# Altium schematic sheet GPS_tracker MCU.SchDoc
size 420 x 297 mm; SheetNumber: 1; SheetTotal: 3; ProjectTitle: Prj name
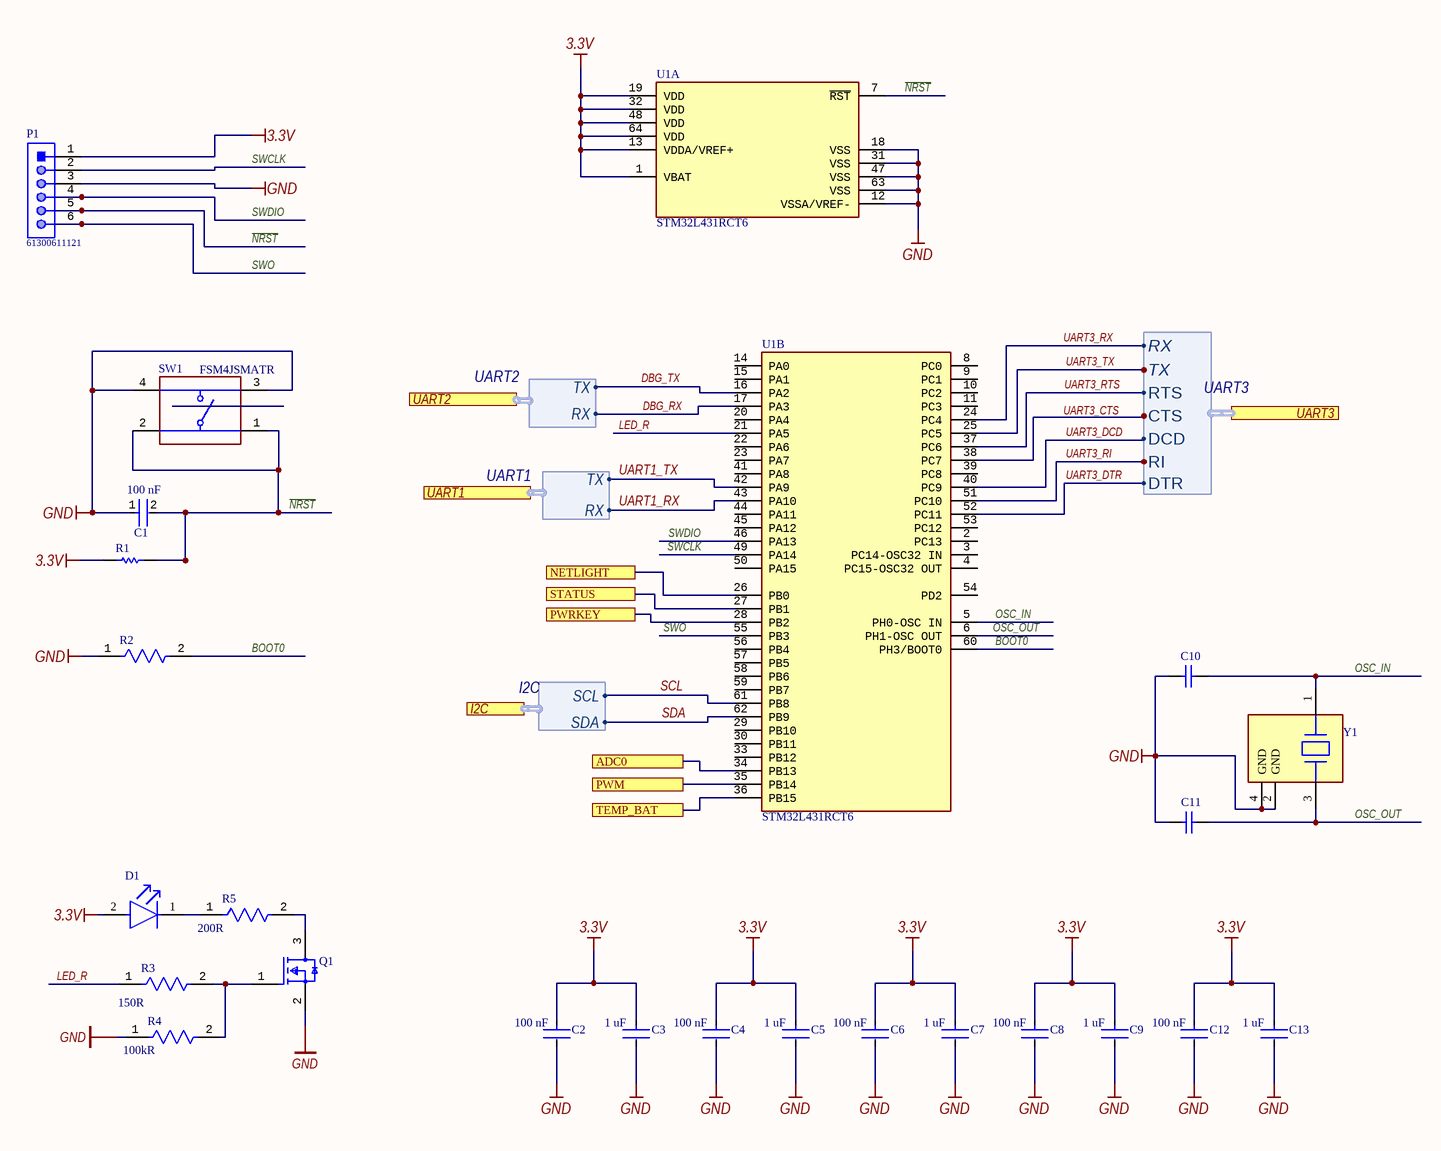
[diagram p0: GPS_tracker MCU.SchDoc]

## Parts
C1  Capacitance: 100 nF  [FP-CC0603-DA-MFG]  (hidden comment: CC0603KRX7R7BB104)
C2  Capacitance: 100 nF  [FP-CC0603-DA-MFG]  (hidden comment: CC0603KRX7R7BB104)
C3  Capacitance: 1 uF  [FP-CC0603-DA-MFG]  (hidden comment: CC0603KRX7R7BB105)
C4  Capacitance: 100 nF  [FP-CC0603-DA-MFG]  (hidden comment: CC0603KRX7R7BB104)
C5  Capacitance: 1 uF  [FP-CC0603-DA-MFG]  (hidden comment: CC0603KRX7R7BB105)
C6  Capacitance: 100 nF  [FP-CC0603-DA-MFG]  (hidden comment: CC0603KRX7R7BB104)
C7  Capacitance: 1 uF  [FP-CC0603-DA-MFG]  (hidden comment: CC0603KRX7R7BB105)
C8  Capacitance: 100 nF  [FP-CC0603-DA-MFG]  (hidden comment: CC0603KRX7R7BB104)
C9  Capacitance: 1 uF  [FP-CC0603-DA-MFG]  (hidden comment: CC0603KRX7R7BB105)
C10  CC0603JRNPO9BN180  [CAPC1608X90X40LL10T20]  (value not drawn)
C11  CC0603JRNPO9BN180  [CAPC1608X90X40LL10T20]  (value not drawn)
C12  Capacitance: 100 nF  [FP-CC0603-DA-MFG]  (hidden comment: CC0603KRX7R7BB104)
C13  Capacitance: 1 uF  [FP-CC0603-DA-MFG]  (hidden comment: CC0603KRX7R7BB105)
D1  150060RS75000  [FP-150060RS75000-MFG]  (value not drawn)
P1  61300611121  [61300611121]
Q1  MMBF170LT1G  [FP-318-08-IPC_B]  (value not drawn)
R1  ERJ3EKF1002V  [RESC1609X55X30LL15T15]  (value not drawn)
R2  AC0603FR-071KL  [FP-AC0603-IPC_B]  (value not drawn)
R3  Resistance: 150R  [FP-AC0603-MFG]  (hidden comment: AC0603FR-07150RL)
R4  Resistance: 100kR  [FP-RC0603-0_55-MFG]  (hidden comment: RC0603FR-07100KL)
R5  Resistance: 200R  [FP-ERJ3EK-IPC_C]  (hidden comment: ERJ-3EKF2000V)
SW1  FSM4JSMATR  [TECO-FSM4JSMATR_V]
U1  STM32L431RCT6  [FP-LQFP64-5W-MFG]  (parts A,B of 2)
Y1  ABM3B-8.000MHZ-B2-T  [FP-ABM3B-MFG]  (value not drawn)

## Ports
ADC0, I2C (harness I2C), NETLIGHT, PWM, PWRKEY, STATUS, TEMP_BAT, UART1 (harness UART1), UART2 (harness UART2), UART3 (harness UART3)

## Harnesses
UART1: RX, TX
UART2: RX, TX
I2C: SCL, SDA
UART3: RX, TX, RTS, CTS, DCD, RI, DTR

## Nets
3.3V: C2.1 C3.1 C4.1 C5.1 C6.1 C7.1 C8.1 C9.1 C12.1 C13.1 D1.2(A) P1.1 R1.1 U1.1(VBAT) U1.13(VDDA/VREF+) U1.19(VDD) U1.32(VDD) U1.48(VDD) U1.64(VDD)
GND: C1.1 C2.2 C3.2 C4.2 C5.2 C6.2 C7.2 C8.2 C9.2 C10.1 C11.1 C12.2 C13.2 P1.3 Q1.2(S) R2.1 R4.1 SW1.3 SW1.4 U1.12(VSSA/VREF-) U1.18(VSS) U1.31(VSS) U1.47(VSS) U1.63(VSS) Y1.2(GND) Y1.4(GND)
ADC0: U1.34(PB13) ; port ADC0
BOOT0: R2.2 U1.60(PH3/BOOT0)
DBG_RX: U1.17(PA3) ; port UART2.RX
LED_R: R3.1 U1.21(PA5)
~{NRST}: C1.2 P1.5 R1.2 SW1.1 SW1.2 U1.7(~{RST})
NETLIGHT: U1.26(PB0) ; port NETLIGHT
OSC_IN: C10.2 U1.5(PH0-OSC_IN) Y1.1
OSC_OUT: C11.2 U1.6(PH1-OSC_OUT) Y1.3
PWM: U1.35(PB14) ; port PWM
PWRKEY: U1.28(PB2) ; port PWRKEY
SCL: U1.61(PB8) ; port I2C.SCL
SDA: U1.62(PB9) ; port I2C.SDA
STATUS: U1.27(PB1) ; port STATUS
SWCLK: P1.2 U1.49(PA14)
SWDIO: P1.4 U1.46(PA13)
SWO: P1.6 U1.55(PB3)
TEMP_BAT: U1.36(PB15) ; port TEMP_BAT
UART1_RX: U1.43(PA10) ; port UART1.RX
UART1_TX: U1.42(PA9) ; port UART1.TX
UART3_DCD: U1.40(PC9) ; port UART3.DCD
UART3_DTR: U1.52(PC11) ; port UART3.DTR
UART3_RI: U1.51(PC10) ; port UART3.RI
UART3_RTS: U1.37(PC6) ; port UART3.RTS
UART3_RX: U1.24(PC4) ; port UART3.RX
UART3_TX: U1.25(PC5) ; port UART3.TX
NetD1_1: D1.1(C) R5.1
NetQ1_1: Q1.1(G) R3.2 R4.2
NetQ1_3: Q1.3(D) R5.2
NetU1_16: U1.16(PA2) ; port UART2.TX
NetU1_38: U1.38(PC7) ; port UART3.CTS

Not connected (* = marked no-connect by the designer): U1 2(PC13) 3(PC14-OSC32_IN) 4(PC15-OSC32_OUT) 8(PC0) 9(PC1) 10(PC2) 11(PC3) 14(PA0) 15(PA1) 20(PA4) 22(PA6) 23(PA7) 29(PB10) 30(PB11) 33(PB12) 39(PC8) 41(PA8) 44(PA11) 45(PA12) 50(PA15) 53(PC12) 54(PD2) 56(PB4) 57(PB5) 58(PB6) 59(PB7)

## Notes on the sheet
- Labels drawn without touching a wire or pin: DBG_TX, UART3_CTS
- Title:
- Author:
- Approved:
- Size:
- Date:
- Git Hash:
- A3
- Prj:
- Sheet
- of
- SW Version:
- Variant:
- Edited:
- CONFIDENTIAL
- File:

## Library data of the parts
C1 C2 C4 C6 C8 C12 = CMP-2000-05002-2: CAP CER 0.1UF 16V X7R 0603; Manufacturer: YAGEO; Tolerance: 0.1; Value: 100 nF; Temperature Coefficient: 15%; Material: Ceramic; Voltage Rating: 16 V; Package: CC0603-DA; ComponentLink2Description: Datasheet; Octopart: https://octopart.com/cc0603krx7r7bb104-yageo-192941; Temperature Range High: +125°C; Digikey Description: CAP CER 0.1UF 16V X7R 0603; Voltage: 16 V; Device Class L2: Capacitors; Height: 0.9mm; Temperature: -55°C to +125°C; Manufacturer Part Number: CC0603KRX7R7BB104; Device Class L1: Passive Components; Device Class L3: Ceramic Capacitors; ComponentLink2URL: http://www.yageo.com/documents/recent/UPY-GPHC_X7R_6.3V-to-50V_18.pdf; Footprint Url: http://www.yageo.com/exep/pages/download/literatures/UPY-C_GEN_24.pdf; RoHS: TRUE; Temperature Range Low: -55°C; Temperature Characteristic: X7R; Lead Free: Yes; Category: Cap; Mouser Description: Multilayer Ceramic Capacitor, CC Series, 0.1 - F, - 10%, X7R, 16 V, 0603 [1608 Metric]; Automotive: No
C3 C5 C7 C9 C13 = CMP-03422-000924-1: CAP CER 1UF 16V X7R 0603; Manufacturer: YAGEO; Tolerance: 0.1; Temperature Coefficient: 15%; Material: Ceramic; Package: CC0603-DA; RoHS: TRUE; Device Class L2: Capacitors; Temperature Characteristic: X7R; Temperature: -55°C to +125°C; Temperature Range Low: -55°C; Automotive: No; ComponentLink2Description: Datasheet; Value: 1 uF; Lead Free: Yes; ComponentLink2URL: http://www.yageo.com/documents/recent/UPY-GPHC_X7R_6.3V-to-50V_18.pdf; Device Class L1: Passive Components; Voltage: 16 V; Octopart: https://octopart.com/cc0603krx7r7bb105-yageo-42271928; Category: Cap; Digikey Description: CAP CER 1UF 16V X7R 0603; Footprint Url: http://www.yageo.com/exep/pages/download/literatures/UPY-C_GEN_24.pdf; Height: 0.9mm; Manufacturer Part Number: CC0603KRX7R7BB105; Voltage Rating: 16 V; Temperature Range High: +125°C; Mouser Description: Multilayer Ceramic Capacitor, CC Series, 1 - F, - 10%, X7R, 16 V, 0603 [1608 Metric]; Device Class L3: Ceramic Capacitors
C10 C11 = CMP-1659-00030-1: Chip Capacitor, 18 pF, +/- 5%, 50 V, -55 to 125 degC, 0603 (1608 Metric), RoHS, Tape and Reel; Voltage Rating: 50 V; Case\Package: 0603; Power Rating: 100 mW; Resistance: 68.1 Ohm; Tolerance: 1%; Case Code (Metric): 1608; Max Operating Temperature: 155 degC; RoHSCompliant: true; Case Code (Imperial): 0603; ComponentLink2Description: Datasheet; Package Quantity: 200; PackageReference: 0603; ComponentLink2URL: http://www.yageo.com/NewPortal/yageodocoutput?fileName=/pdf/MLCC/UPY-GP_NP0_16V-to-50V_14.pdf; Length: 1.6 mm; DatasheetVersion: Rev. 14, 07/2016; Min Operating Temperature: -55 degC; ComponentLink1URL: http://www.yageo.com/; Width: 0.8 mm; ComponentLink1Description: Manufacturer URL; Height: 0.45 mm; Radiation Hardening: No; PackageDescription: 2-Pin Surface Mount Device, Body 1.6 x 0.8 mm; Packaging: Tape and Reel
D1 = CMP-1426-00001-2: LED RED CLEAR 0603 SMD; Luminous Intensity: 250mcd; Viewing Angle: 140°; Dominant Wavelength: 625nm; Test Current: 20mA; Forward Current: 30mA; Forward Voltage: 2V; Lens Color: Colorless; Lens Size: 0.7mm; Width: 0.8mm; Series: WL-SMCW; Color: Red; Min Operating Temperature: -40°C; RoHS Compliant: Yes; Height: 0.8mm; Package Quantity: 1; Packaging: Cut Tape; Mount: Surface Mount; Case/Package: 0603; Lens Transparency: Clear; Length: 1.6mm; Case Code (Imperial): 0603; Lens Style: Clear; Wavelength: 625nm; Max Operating Temperature: 85°C; Case Code (Metric): 1608
P1 = CMP-1502-01070-1: THT Vertical Pin Header WR-PHD, Pitch 2.54 mm, Single Row, 6 pins; Manufacturer: Wurth Elektronik; Gender: Male; Pin Number: 6; Pitch: 2.54mm; Working Voltage: 250VAC; Rated Current: 3A; Withstanding Voltage: 500VAC; Contact Resistance: 20mOhm; Operating Temperature: -40to105degC; Packaging: Bag; Datasheet URL: https://katalog.we-online.de/em/datasheet/6130xx11121.pdf; Package Reference: 61300611121; Mounting Technology: THT; Publisher: WurthElektronik; Part Number: 61300611121; Manufacturer URL: http://www.we-online.de; Row Number: Single; Orientation: Vertical
Q1 = CMP-1058-00793-2: MOSFET N-CH 60V 500MA SOT-23; Polarization: N; Rds On Max: 5R; Power Dissipation: 225mW; Number of Elements: 1; Element Configuration: Single; Input Capacitance: 60pF; Threshold Voltage: 3V; Polarity: N-CHANNEL; Gate to Source Voltage (Vgs): 20V; Turn-Off Delay Time: 10ns; Drain to Source Breakdown Voltage: 60V; On-State Resistance: 5R; Width: 1.3mm; Voltage Rating (DC): 60V; Package Quantity: 3000; Max Operating Temperature: 150°C; Drain to Source Resistance: 5R; Drain-source On Resistance-Max: 5R; Packaging: Tape and Reel; REACH SVHC: No SVHC; Case/Package: SOT-23-3; Number of Pins: 3; RoHS Compliant: Yes; Radiation Hardening: No; Min Operating Temperature: -55°C; Continuous Drain Current (ID): 500mA; Lead Free: Lead Free; Height: 0.94mm; Current Rating: 500mA; Turn-On Delay Time: 10ns; Series: -; Max Power Dissipation: 225mW; Length: 2.9mm; Nominal Vgs: 3V
R1 = CMP-1012-00623-3: Chip Resistor, 10 KOhm, +/- 1%, 0.1 W, -55 to 155 degC, 0603 (1608 Metric), RoHS, Tape and Reel; Manufacturer: Panasonic; Voltage Rating: 75V; Case\/Package: 0603; Power Rating: 100mW; Resistance: 10KOhm; Temperature Coefficient: 100ppm\/degreesC; Number of Pins: 2; Package Reference: 603; Depth: 0.8mm; Mount: SurfaceMount; Package Description: 2-Pin Surface Mount Device, Body 1.6 x 0.85 mm; Datasheet Version: 02/2017; Length: 1.6mm; Lead Free: LeadFree; Height: 0.45mm; Number of Terminations: 2; Max Power Dissipation: 100mW; Min Operating Temperature: -55degC; Datasheet URL: https://industrial.panasonic.com/cdbs/www-data/pdf/RDA0000/AOA0000C304.pdf; Termination: SMD/SMT; Case Code (Metric): 1608; Case Code (Imperial): 0603; Tolerance: 1%; Max Operating Temperature: 155degC; RoHSCompliant: true; Voltage Rating (DC): 75V; Radiation Hardening: No; Packaging: TapeandReel; Composition: ThickFilm; Mounting Technology: SurfaceMount; Manufacturer URL: http://www.panasonic.com/; Width: 0.031inch; REACH SVHC: NoSVHC; Contact Plating: Tin; Military Standard: Not; Package Quantity: 1
R2 = CMP-2000-04828-3: RES 1kΩ 1.00% 0.1W 0603; Voltage Rating: 50V; Power Rating: 100mW; Tolerance: 1%; Temperature Coefficient: 100ppm/°C; Resistance: 1kR; Depth: 0.8mm; Case/Package: 0603; Size Code: 0603; Case Code (Metric): 1608; Height: 0.022inch; Series: AC; Width: 0.031inch; Construction: Rectangular; Length: 0.063inch; Case Code (Imperial): 0603; Package Quantity: 1; RoHS Compliant: Yes; Features: Moisture Resistant; Resistor Type: Thick Film; Max Power Dissipation: 100mW; Packaging: Tape and Reel; Termination: SMD/SMT; Ratings: AEC-Q200; Max Operating Temperature: 155°C; Min Operating Temperature: -55°C; Military Standard: Not; Lead Free: Lead Free; Number of Terminations: 2
R3 = CMP-2000-04821-3: RES 150Ω 1.00% 0.1W 0603; Voltage Rating: 50V; Power Rating: 100mW; Temperature Coefficient: 100ppm/°C; Tolerance: 1%; Resistor Type: Thick Film; Features: Moisture Resistant; Ratings: AEC-Q200; Width: 0.8mm; Packaging: Tape and Reel; Case/Package: 0603; Series: AC; RoHS Compliant: Yes; Max Power Dissipation: 100mW; Case Code (Imperial): 0603; Min Operating Temperature: -55°C; Height: 0.45mm; Termination: SMD/SMT; Number of Terminations: 2; Case Code (Metric): 1608; Max Operating Temperature: 155°C; Length: 1.6mm
R4 = CMP-2100-03662-2: RES SMD 100K OHM 1% 1/10W 0603; Voltage Rating (DC): 50V; Max Power Dissipation: 100mW; Temperature Coefficient: 100ppm/°C; Working Voltage: 75V; Length: 1.6mm; Lead Free: Lead Free; Number of Terminations: 2; Packaging: Tape and Reel; Voltage Rating: 50V; Termination: SMD/SMT; Width: 0.8mm; Resistor Type: Thick Film; Resistance Tolerance: 1%; Features: Moisture Resistant; Height: 0.45mm; Construction: Rectangular; Case/Package: 0603; Military Standard: Not; Case Code (Imperial): 0603; Series: RC; Technology: THICK FILM; Depth: 0.8mm; RoHS Compliant: Yes; REACH SVHC: No SVHC; Min Operating Temperature: -55°C; Case Code (Metric): 1608; Max Operating Temperature: 155°C; Power Rating: 100mW; Number of Pins: 2; Tolerance: 1%
R5 = CMP-2000-00316-2: RES SMD 200 OHM 1% 1/10W 0603; Power Rating: 100mW; Temperature Coefficient: 100ppm/°C; Voltage Rating (DC): 50V; Voltage Rating: 75V; Tolerance: 1%; Lead Free: Lead Free; Packaging: Tape and Reel; Case/Package: 0603; Contact Plating: Tin; Case Code (Imperial): 0603; Min Operating Temperature: -55°C; Max Operating Temperature: 155°C; Max Power Dissipation: 100mW; Features: Automotive AEC-Q200; Technology: THICK FILM; Package Quantity: 1; Resistor Type: Thick Film; REACH SVHC: No SVHC; Termination: SMD/SMT; Length: 1.6mm; Resistance Tolerance: 1%; Series: ERJ; Military Standard: Not; Radiation Hardening: No; Working Voltage: 75V; Case Code (Metric): 1608; RoHS Compliant: Yes; Mount: Surface Mount; Construction: Rectangular; Width: 0.031inch; Number of Terminations: 2; Depth: 0.8mm; Height: 0.022inch
SW1 = CMP-2000-07486-1: Micro Miniature Push Button Switch FSM JSM, 50 mA, -35 to 85 degC, 4-Pin SMD, RoHS, Tape and Reel; Manufacturer: TE Connectivity; Mechanical Life: 100000Cycles; Current Rating: 50mA; Actuator Material: Polyamide; Max Voltage Rating (DC): 12V; Capacitance: 0f; Illumination Type: Illuminated; Voltage Rating (DC): 24V; Case\/Package: SMD/SMT; Operating Force: 160gf; Contact Resistance: 100mOhm; Actuator Length: 0.055inch; Switch Travel: 0.25mm; Throw Configuration: SPST; Termination: GullWing; Contact Plating: Silver; Orientation: Straight; Mounting Technology: SurfaceMount; REACH SVHC: Unknown; Electrical Life: 100000Cycles; Package Reference: FSM4JSMATR; Max Operating Temperature: 85degC; Manufacturer URL: http://www.te.com/; Package Description: 4-Pin Surface Mount Device, Body 6 x 6 mm, Pitch 4.5 mm; Datasheet Version: Rev. V, 02/2015; Packaging: TapeandReel; Min Operating Temperature: -35degC; Mount: SurfaceMount; Contact Current Rating: 50mA; Contact Material: CopperAlloy; Package Quantity: 1200; Datasheet URL: http://www.te.com/commerce/DocumentDelivery/DDEController?Action=showdoc&DocId=Customer+Drawing%7F2-1437565-7%7FV%7Fpdf%7FEnglish%7FENG_CD_2-1437565-7_V.pdf%7F4-1437565-2; RoHSCompliant: true
U1 = CMP-12105-000010-1: IC MCU 32BIT 256KB FLASH 64LQFP; Manufacturer: STMicroelectronics; Number Of I/Os: 52; Core Architecture: ARM Cortex-M4; Number Of Pwm Channels: 11; Frequency: 80MHz; Number Of A/D Converters: 1; Number Of Timers/Counters: 8; Standoff Height: 0.05mm; Min Supply Voltage: 1.62V; Memory Size: 256KBytes; Max Supply Voltage: 3.6V; Max Junction Temp: +105°C; Interface: I2C,SPI,USART,CAN,LIN,IrDA,Other; Number Of Spi Channels: 3; Number Of Uart Channels: 4; Data Bus Width: 32bits; Number Of Adc Channels: 16; Ram Size: 64KBytes; Manufacturer Part Number: STM32L431RCT6; Digikey Description: IC MCU 32BIT 256KB FLASH 64LQFP; Device Class L3: Microcontrollers; Device Class L1: Integrated Circuits (ICs); Octopart: https://octopart.com/stm32l431rct6-stmicroelectronics-74606534; Number Of Cores: 1; Automotive: No; Device Class L2: Embedded Processors and Controllers; ComponentLink2URL: https://www.st.com/resource/en/datasheet/stm32l431rc.pdf; Height: 1.6mm; Ambient Temperature Range High: +85°C; Temperature Range High: +105°C; Ambient Temperature Range Low: -40°C; Category: IC; Memory Type: FLASH; Package: LQFP64-5W; Temperature Range Low: -40°C; Lead Free: Yes; Mouser Description: MCU 32-Bit STM32 ARM Cortex M4 RISC 256KB Flash 1.8V/2.5V/3.3V 64-Pin LQFP Tray; Temperature: -40°C to +105°C; ComponentLink2Description: Datasheet; Number Of I2C Channels: 3; RoHS: TRUE
Y1 = CMP-1688-00002-2: Crystal 8MHz ±20ppm 18pF SMD-4 5mm x 3.2mm; ESR (Equivalent Series Resistance): 200R; Frequency Stability: 50ppm; Operating Frequency: 8 MHz; Mount: Surface Mount; Number of Pins: 4; Packaging: Tape and Reel; Width: 0.126inch; Case/Package: CSMD; Lead Free: Lead Free; Depth: 3.2mm; Load Capacitance: 18pF; Min Operating Temperature: -20°C; Series: ABM3B; Package Quantity: 1000; Resistor Type: Ceramic; Height: 0.043inch; Max Operating Temperature: 70°C; Frequency Tolerance: 20ppm; Series Resistance: 200R; Tolerance: 20ppm; Termination: SMD/SMT; Length: 5mm; Frequency: 8MHz